# EAGLE schematic Ethernet module (EAGLE 9.0.1)
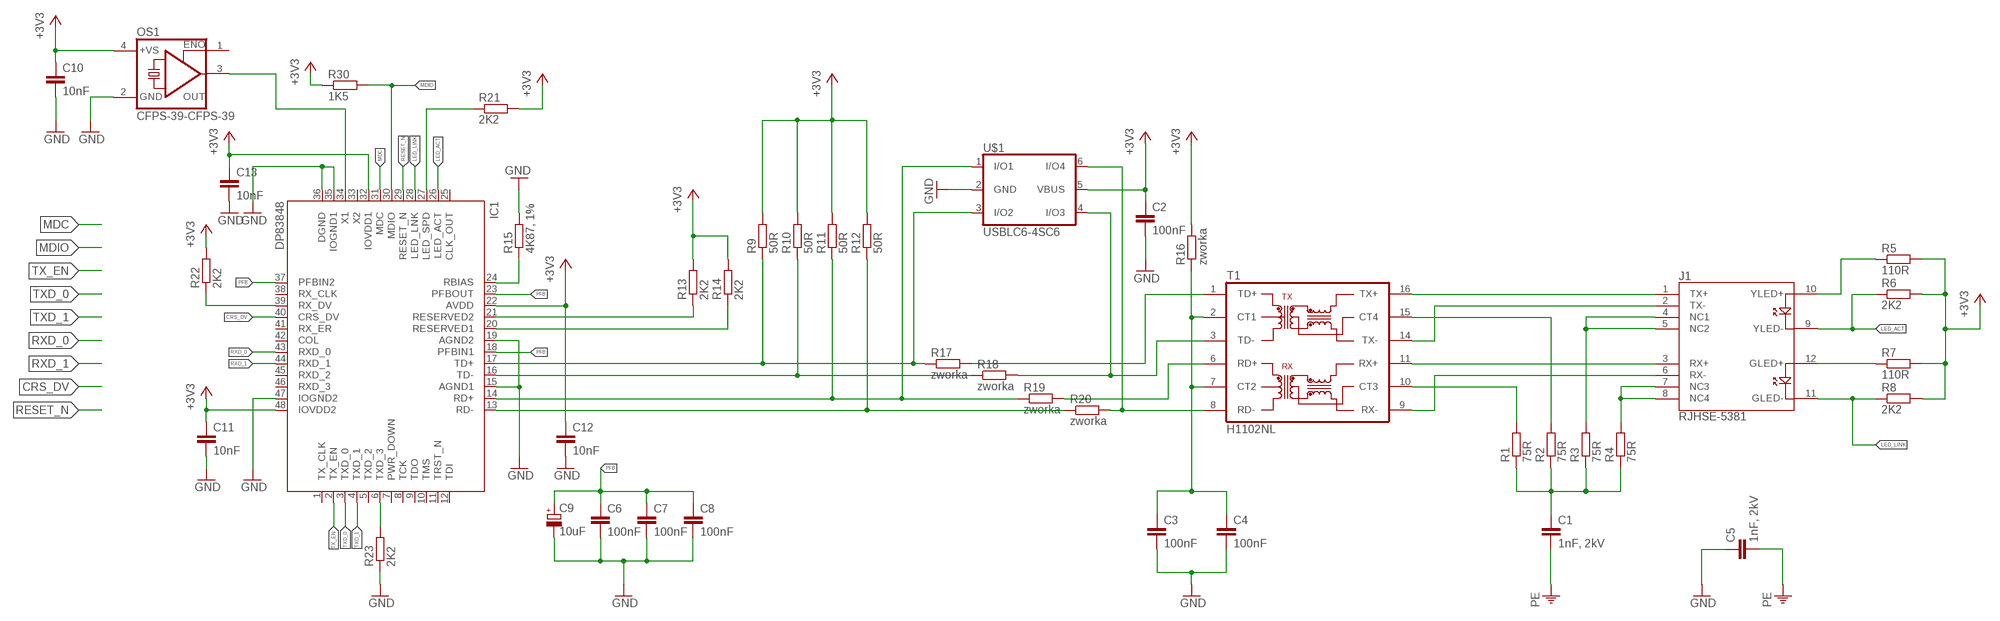
[diagram p0: schematic, sheet 1]

## Parts
C1  1nF, 2kV  C-EUC1206  [C1206]
C2  100nF  C-EUC0603  [C0603]
C3  100nF  C-EUC0603  [C0603]
C4  100nF  C-EUC0603  [C0603]
C5  1nF, 2kV  C-EUC1206  [C1206]
C6  100nF  C-EUC0603  [C0603]
C7  100nF  C-EUC0603  [C0603]
C8  100nF  C-EUC0603  [C0603]
C9  10uF  CPOL-EUSMCA  [SMC_A]
C10  10nF  C-EUC0603  [C0603]
C11  10nF  C-EUC0603  [C0603]
C12  10nF  C-EUC0603  [C0603]
C13  10nF  C-EUC0603  [C0603]
IC1  DP83848  [LQFP48]
J1  RJHSE-5381  [MAGJACK-19938]
OS1  CFPS-39-CFPS-39  [3.4X2.7-4-PAD]
R1  75R  R-EU_R0603  [R0603]
R2  75R  R-EU_R0603  [R0603]
R3  75R  R-EU_R0603  [R0603]
R4  75R  R-EU_R0603  [R0603]
R5  110R  R-EU_R0603  [R0603]
R6  2K2  R-EU_R0603  [R0603]
R7  110R  R-EU_R0603  [R0603]
R8  2K2  R-EU_R0603  [R0603]
R9  50R  R-EU_R0603  [R0603]
R10  50R  R-EU_R0603  [R0603]
R11  50R  R-EU_R0603  [R0603]
R12  50R  R-EU_R0603  [R0603]
R13  2K2  R-EU_R0603  [R0603]
R14  2K2  R-EU_R0603  [R0603]
R15  4K87, 1%  R-EU_R0603  [R0603]
R16  zworka  R-EU_R0603  [R0603]
R17  zworka  R-EU_R0603  [R0603]
R18  zworka  R-EU_R0603  [R0603]
R19  zworka  R-EU_R0603  [R0603]
R20  zworka  R-EU_R0603  [R0603]
R21  2K2  R-EU_R0603  [R0603]
R22  2K2  R-EU_R0603  [R0603]
R23  2K2  R-EU_R0603  [R0603]
R30  1K5  R-EU_R0603  [R0603]
T1  H1102NL  HX1188  [HXXXX]
U$1  USBLC6-4SC6  [SOT23-6]

## Nets
+3V3: C2.1 C10.1 C11.1 C12.1 C13.1 IC1.22(AVDD) IC1.32(IOVDD1) IC1.48(IOVDD2) OS1.4(VDD) R5.2 R6.2 R7.2 R8.2 R9.2 R10.2 R11.2 R12.2 R13.2 R14.2 R16.2 R21.2 R22.2 R30.1 U$1.5(VBUS)
CRS_DV: IC1.40(CRS_DV)
GND: C2.2 C3.2 C4.2 C5.1 C6.2 C7.2 C8.2 C9.- C10.2 C11.2 C12.2 C13.2 IC1.15(AGND1) IC1.19(AGND2) IC1.35(IOGND1) IC1.36(DGND) IC1.47(IOGND2) OS1.2(VSS) R15.2 R23.1 U$1.2(GND)
LED_ACT: IC1.26(LED_ACT) J1.9(YLED-) R6.1
LED_LINK: IC1.28(LED_LNK) J1.11(GLED-) R8.1
MDC: IC1.31(MDC)
MDIO: IC1.30(MDIO) R30.2
N$1: J1.1(TX+) T1.16(TX+)
N$2: J1.2(TX-) T1.14(TX-)
N$3: J1.3(RX+) T1.11(RX+)
N$4: J1.6(RX-) T1.9(RX-)
N$5: J1.4(NC1) J1.5(NC2) R3.2
N$6: IC1.17(TD+) R9.1 R17.1 U$1.3(I/O2)
N$7: J1.7(NC3) J1.8(NC4) R4.2
N$8: R2.2 T1.15(CT4)
N$9: R1.2 T1.10(CT3)
N$10: C1.1 R1.1 R2.1 R3.1 R4.1
N$11: J1.12(GLED+) R7.1
N$12: IC1.16(TD-) R10.1 R18.1
N$13: IC1.14(RD+) R11.1 R19.1 U$1.1(I/O1)
N$14: J1.10(YLED+) R5.1
N$15: IC1.13(RD-) R12.1 R20.1
N$16: C3.1 C4.1 R16.1 T1.2(CT1) T1.7(CT2)
N$17: IC1.21(RESERVED2) R13.1
N$18: IC1.20(RESERVED1) R14.1
N$19: R18.2 T1.3(TD-) U$1.4(I/O3)
N$20: R17.2 T1.1(TD+)
N$21: IC1.24(RBIAS) R15.1
N$22: R19.2 T1.6(RD+)
N$23: R20.2 T1.8(RD-) U$1.6(I/O4)
N$24: IC1.27(LED_SPD) R21.1
N$25: IC1.39(RX_DV) R22.1
N$26: IC1.34(X1) OS1.3(OUT)
N$27: IC1.6(TXD_3) R23.2
PE: C1.2 C5.2
PFB: C6.1 C7.1 C8.1 C9.+ IC1.18(PFBIN1) IC1.23(PFBOUT) IC1.37(PFBIN2)
RESET_N: IC1.29(RESET_N)
RXD_0: IC1.43(RXD_0)
RXD_1: IC1.44(RXD_1)
TX_EN: IC1.2(TX_EN)
TXD_0: IC1.3(TXD_0)
TXD_1: IC1.4(TXD_1)
Unconnected: IC1.1(TX_CLK) IC1.5(TXD_2) IC1.7(PWR_DOWN) IC1.8(TCK) IC1.9(TDO) IC1.10(TMS) IC1.11(TRST_N) IC1.12(TDI) IC1.25(CLK_OUT) IC1.33(X2) IC1.38(RX_CLK) IC1.41(RX_ER) IC1.42(COL) IC1.45(RXD_2) IC1.46(RXD_3) OS1.1(CON)

## Library data of the parts
C1-C8 C10-C13 = rcl:C-EU: CAPACITOR, European symbol; SPICEPREFIX: C
C9 = rcl:CPOL-EU: POLARIZED CAPACITOR, European symbol; SPICEPREFIX: C
IC1 = fx_workspace:DP83848: PHYTER® - Extended Temperature Single Port 10/100 Mb/s Ethernet Physical Layer Transceiver Auto generated by make-symbol-device-package-bsdl.ulp Rev. 34 Source: dp83848yb.bsdl http://www.national.com/ds/DP/DP83848VYB.pdf; MPN: DP83848VYB; OC_FARNELL: 1286817; OC_NEWARK: 11N4484
J1 = fx_workspace:RJHSE-5381: RJ-45 with LEDs
OS1 = fx_workspace:CFPS-39: OSCILLATOR WITH OE
R1-R23 R30 = rcl:R-EU_: RESISTOR, European symbol; SPICEPREFIX: R
T1 = fx_workspace:HX1188: Transformer- H110X, H1121, HX1188
U$1 = fx_workspace:USBLC6-4SC6